# Altium schematic sheet ModBus.SchDoc
size A4; SPICEModelCacheNTQUVIAM: <root> / <DocumentId>NTQUVIAM</DocumentId> / <CacheFrame Number="0"> / <Model Name="tmk107b7105_a-t" Kind="CKT"> / <Text>* TMK107B7105_A-T     SPICE MODEL  ( General Type ) / *-------------------------------------------------------------------------------------------------------- / * Model Generated by TAIYO YUDEN Corporation (http://www.ty-top.com) / * Version 1.0 / * TAIYO YUDEN Control No. 170508_100817 / * Copyright(c) 2012 TAIYO YUDEN CO.,LTD. All Rights Reserved. / *-------------------------------------------------------------------------------------------------------- / * / * Products Name : Multilayer Ceramic Capacitors / * / * Characteristics : / *     Capacitance : 1 uF , Rated Voltage : 25V , TCC : X7R / *     Case Size : 1.6 x 0.8 / 0.063 x 0.031 [mm/inch] , Thickness : 0.8 / 0.031 [mm/inch] / *     (Conditions: Temperature = 25 degC , DC Bias Current/Voltage = 0A / 0V) / * / * Frequency Range : 40Hz - 3GHz / * / * External Node Assignments : / * / *  1  o---| |---o  2 / * / *-------------------------------------------------------------------------------------------------------- / .SubCkt TMK107B7105_A-T 1 2 / **************************** / C0 1 110 0.8077u / Cm 1 101 0.091409u / C1 101 102 0.22841u / Rc1 101 102 2.6849k / C2 102 103 0.056864u / Rc2 102 103 354.66 / C3 103 110 0.05273u / Rc3 103 110 25.631 / C2m 1 301 0.15309u / C21 301 302 0.37938u / Rc21 301 302 9.5172k / C22 302 303 0.45808u / Rc22 302 303 6.9429k / C23 303 304 0.40786u / Rc23 303 304 2.3301k / C24 304 305 0.15311u / Rc24 304 305 806.02 / C25 305 306 0.22413u / Rc25 305 306 462.56 / C26 306 307 0.18632u / Rc26 306 307 35.279 / C27 307 308 0.15722u / Rc27 307 308 39.531 / C28 308 309 0.078196u / Rc28 308 309 48.947 / C29 309 110 6560.8p / Rc29 309 110 9.5708 / Rp0 1 110 100Meg / L0 110 120 0.29644n / Lm 120 130 0.15558n / L1 120 121 0.202n / RL1 121 130 0.16398 / L2 120 122 0.33479n / RL2 122 130 0.31977 / L3 120 123 0.92343n / RL3 123 130 0.85069 / CR 120 124 0.21801u / LR 124 125 0.13885n / RR 125 130 35.905m / CL 130 140 1.934p / LL 130 140 0.19618n / RL 130 140 45.012 / Rs 140 2 6.428m / **************************** / .ends TMK107B7105_A-T</Text> / </Model> / </CacheFrame> / </root>; SheetNumber: 6; SheetTotal: 9
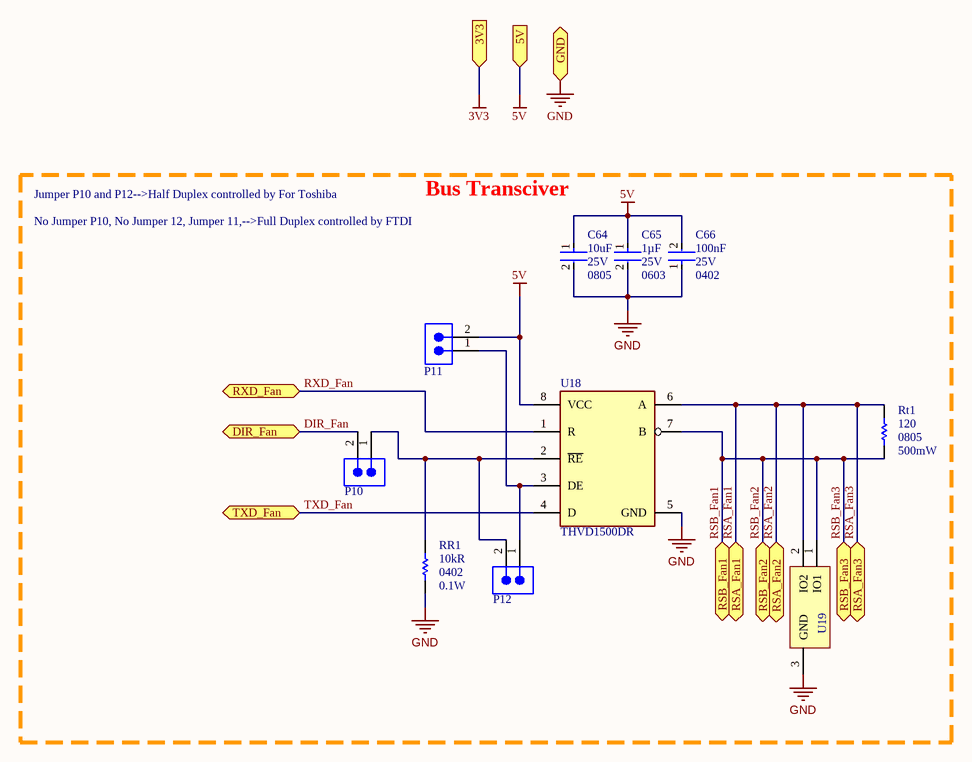
[diagram p0: ModBus.SchDoc]

## Parts
C64  value 10uF  Case/Package: 0805  Voltage Rating: 25V  [FP-CL21-IPC_B]  (hidden comment: CL21A106KAFN3NE)
C65  value 1µF  Voltage Rating: 25V  Case/Package: 0603  [FP-0603-L_1_6_0_1-W_0_8_0-IPC_A]  (hidden comment: TMK107B7105KA-T)
C66  value 100nF  Voltage Rating: 25V  Case/Package: 0402  [FP-CL830-IPC_A]  (hidden comment: CL05B104KA5NNNC)
P10  61300211121  [61300211121]  (value not drawn)
P11  61300211121  [61300211121]  (value not drawn)
P12  61300211121  [61300211121]  (value not drawn)
RR1  value 10kR  Package: 0402  Power Rating: 0.1W  [RESC1005X40X25LL10T10]  (hidden comment: RK73H1ETTP1002F)
Rt1  value 120  Power: 500mW  Case/Package: 0805  [RESC2013X70X40NL20T20]  (hidden comment: ERJ-P06J121V)
U18  THVD1500DR  [FP-D0008B-IPC_A]
U19  TPD2E007DCKR  [DCK0003A_M]  (value not drawn)

## Ports
3V3 (in), 5V (in), DIR_Fan (bidir), GND (bidir), RSA_Fan1 (bidir), RSA_Fan2 (bidir), RSA_Fan3 (bidir), RSB_Fan1 (bidir), RSB_Fan2 (bidir), RSB_Fan3 (bidir), RXD_Fan (bidir), TXD_Fan (bidir)

## Nets
3V3: port 3V3
5V: C64.1 C65.1 C66.2 P11.2 U18.8(VCC) ; port 5V
GND: C64.2 C65.2 C66.1 RR1.1 U18.5(GND) U19.3(GND) ; port GND
DIR_Fan: P10.2 ; port DIR_Fan
RSA_Fan1: Rt1.2 U18.6(A) U19.2(IO2) ; port RSA_Fan1, port RSA_Fan2, port RSA_Fan3  [also labelled RSA_Fan2, RSA_Fan3]
RSB_Fan1: Rt1.1 U18.7(B) U19.1(IO1) ; port RSB_Fan1, port RSB_Fan2, port RSB_Fan3  [also labelled RSB_Fan2, RSB_Fan3]
RXD_Fan: U18.1(R) ; port RXD_Fan
TXD_Fan: U18.4(D) ; port TXD_Fan
NetP10_1: P10.1 P12.2 RR1.2 U18.2(~{RE})
NetP11_1: P11.1 P12.1 U18.3(DE)

## Notes on the sheet
- Jumper P10 and P12-->Half Duplex controlled by For Toshiba
- Bus Transciver
- No Jumper P10, No Jumper 12, Jumper 11,-->Full Duplex controlled by FTDI
- Title:
- Date:
- Drawn By:
- Time:
- Checked By:
- File:
- Sheet
- of

## Library data of the parts
C64 = CMP-13271-000854-1: CL21 Series 0805 10uF 25V ±10% Tolerance X5R Multilayer Ceramic Chip Capacitor; Tolerance: 10%; Package Quantity: 1; Length: 0.079inch; Mount: Surface Mount; Thickness: 0.053inch; Width: 0.049inch; Min Operating Temperature: -55°C; Packaging: Cut Tape; Lead Free: Lead Free; Max Operating Temperature: 85°C; Case Code (Metric): 2012; Case Code (Imperial): 0805
C65 = CMP-001-00326-1: Ceramic Capacitor, Multilayer, Ceramic, 25V, 10% +Tol, 10% -Tol, X7R, 15% TC, 1uF, Surface Mount, 0603; Pins: 2; Capacitor Type: Ceramic; Min Operating Temperature: -55°C; Max Operating Temperature: 125°C; RoHS Compliant: Yes; Mounting Technology: Surface Mount
C66 = CMP-001-00333-1: Ceramic Capacitor, Multilayer, Ceramic, 25V, 10% +Tol, 10% -Tol, X7R, 15% TC, 0.1uF, Surface Mount, 0402; Max Operating Temperature: 125°C; RoHS Compliant: Yes; Capacitor Type: Ceramic; Min Operating Temperature: -55°C; Pins: 2; Mounting Technology: Surface Mount
P10-P12 = CMP-002-00257-1: WR-PHD Pin Header, THT, Vertical, pitch 2.54mm, 1 Row, 2P; Manufacturer: Wurth Elektronik; Contact Resistance: 20mOhm; Working Voltage: 250V; Rated Current: 3A; Withstanding Voltage: 500V; Match Code: WR-PHD; Packaging: Bag; ComponentLink2Description: Datasheet Link; Source: WR-PHD.SchLib; Operating Temperature Max: 105°C; Pin Count: 2; Orientation: Vertical; Gender: Pin Header; Pitch: 2.54mm; Manufacturer Part Number: 61300211121; Mount: Through Hole; ComponentLink1Description: Website Link; ComponentLink2URL: https://www.we-online.com/redexpert/spec/61300211121?ad; Pins: 2; ComponentLink1URL: https://www.we-online.com/redexpert/article/61300211121?ad; Design Item ID: 61300211121; Category: Board-to-Board Connectors; Number of Rows: 1; Component Type: Standard; Operating Temperature Min: -40°C
RR1 = CMP-x00150-2: Fixed Resistor, Metal Glaze/thick Film, 0.1W, 10000ohm, 75V, 1% +/-Tol, 100ppm/Cel, Surface Mount, 0402; Template: KS_0402_R
Rt1 = CMP-009-01034-1: Fixed Resistor, Metal Glaze/thick Film, 0.5W, 120ohm, 400V, 5% +/-Tol, 200ppm/Cel, Surface Mount, 0805; Tolerance: 5%; Pins: 2; RoHS Compliant: Yes; Min Operating Temperature: -55°C; Max Operating Temperature: 155°C; Mounting Technology: Surface Mount
U18 = CMP-00111-1: Line Transceiver, 1 Func, 1 Driver, 1 Rcvr, PDSO8
U19 = CMP-004-00090-1: Trans Voltage Suppressor Diode, 13V V(RWM), Unidirectional, 4 Element, Silicon; Pins: 3; RoHS Compliant: Yes